# EAGLE design PGTNX01_teensy (EAGLE 8.5.2)
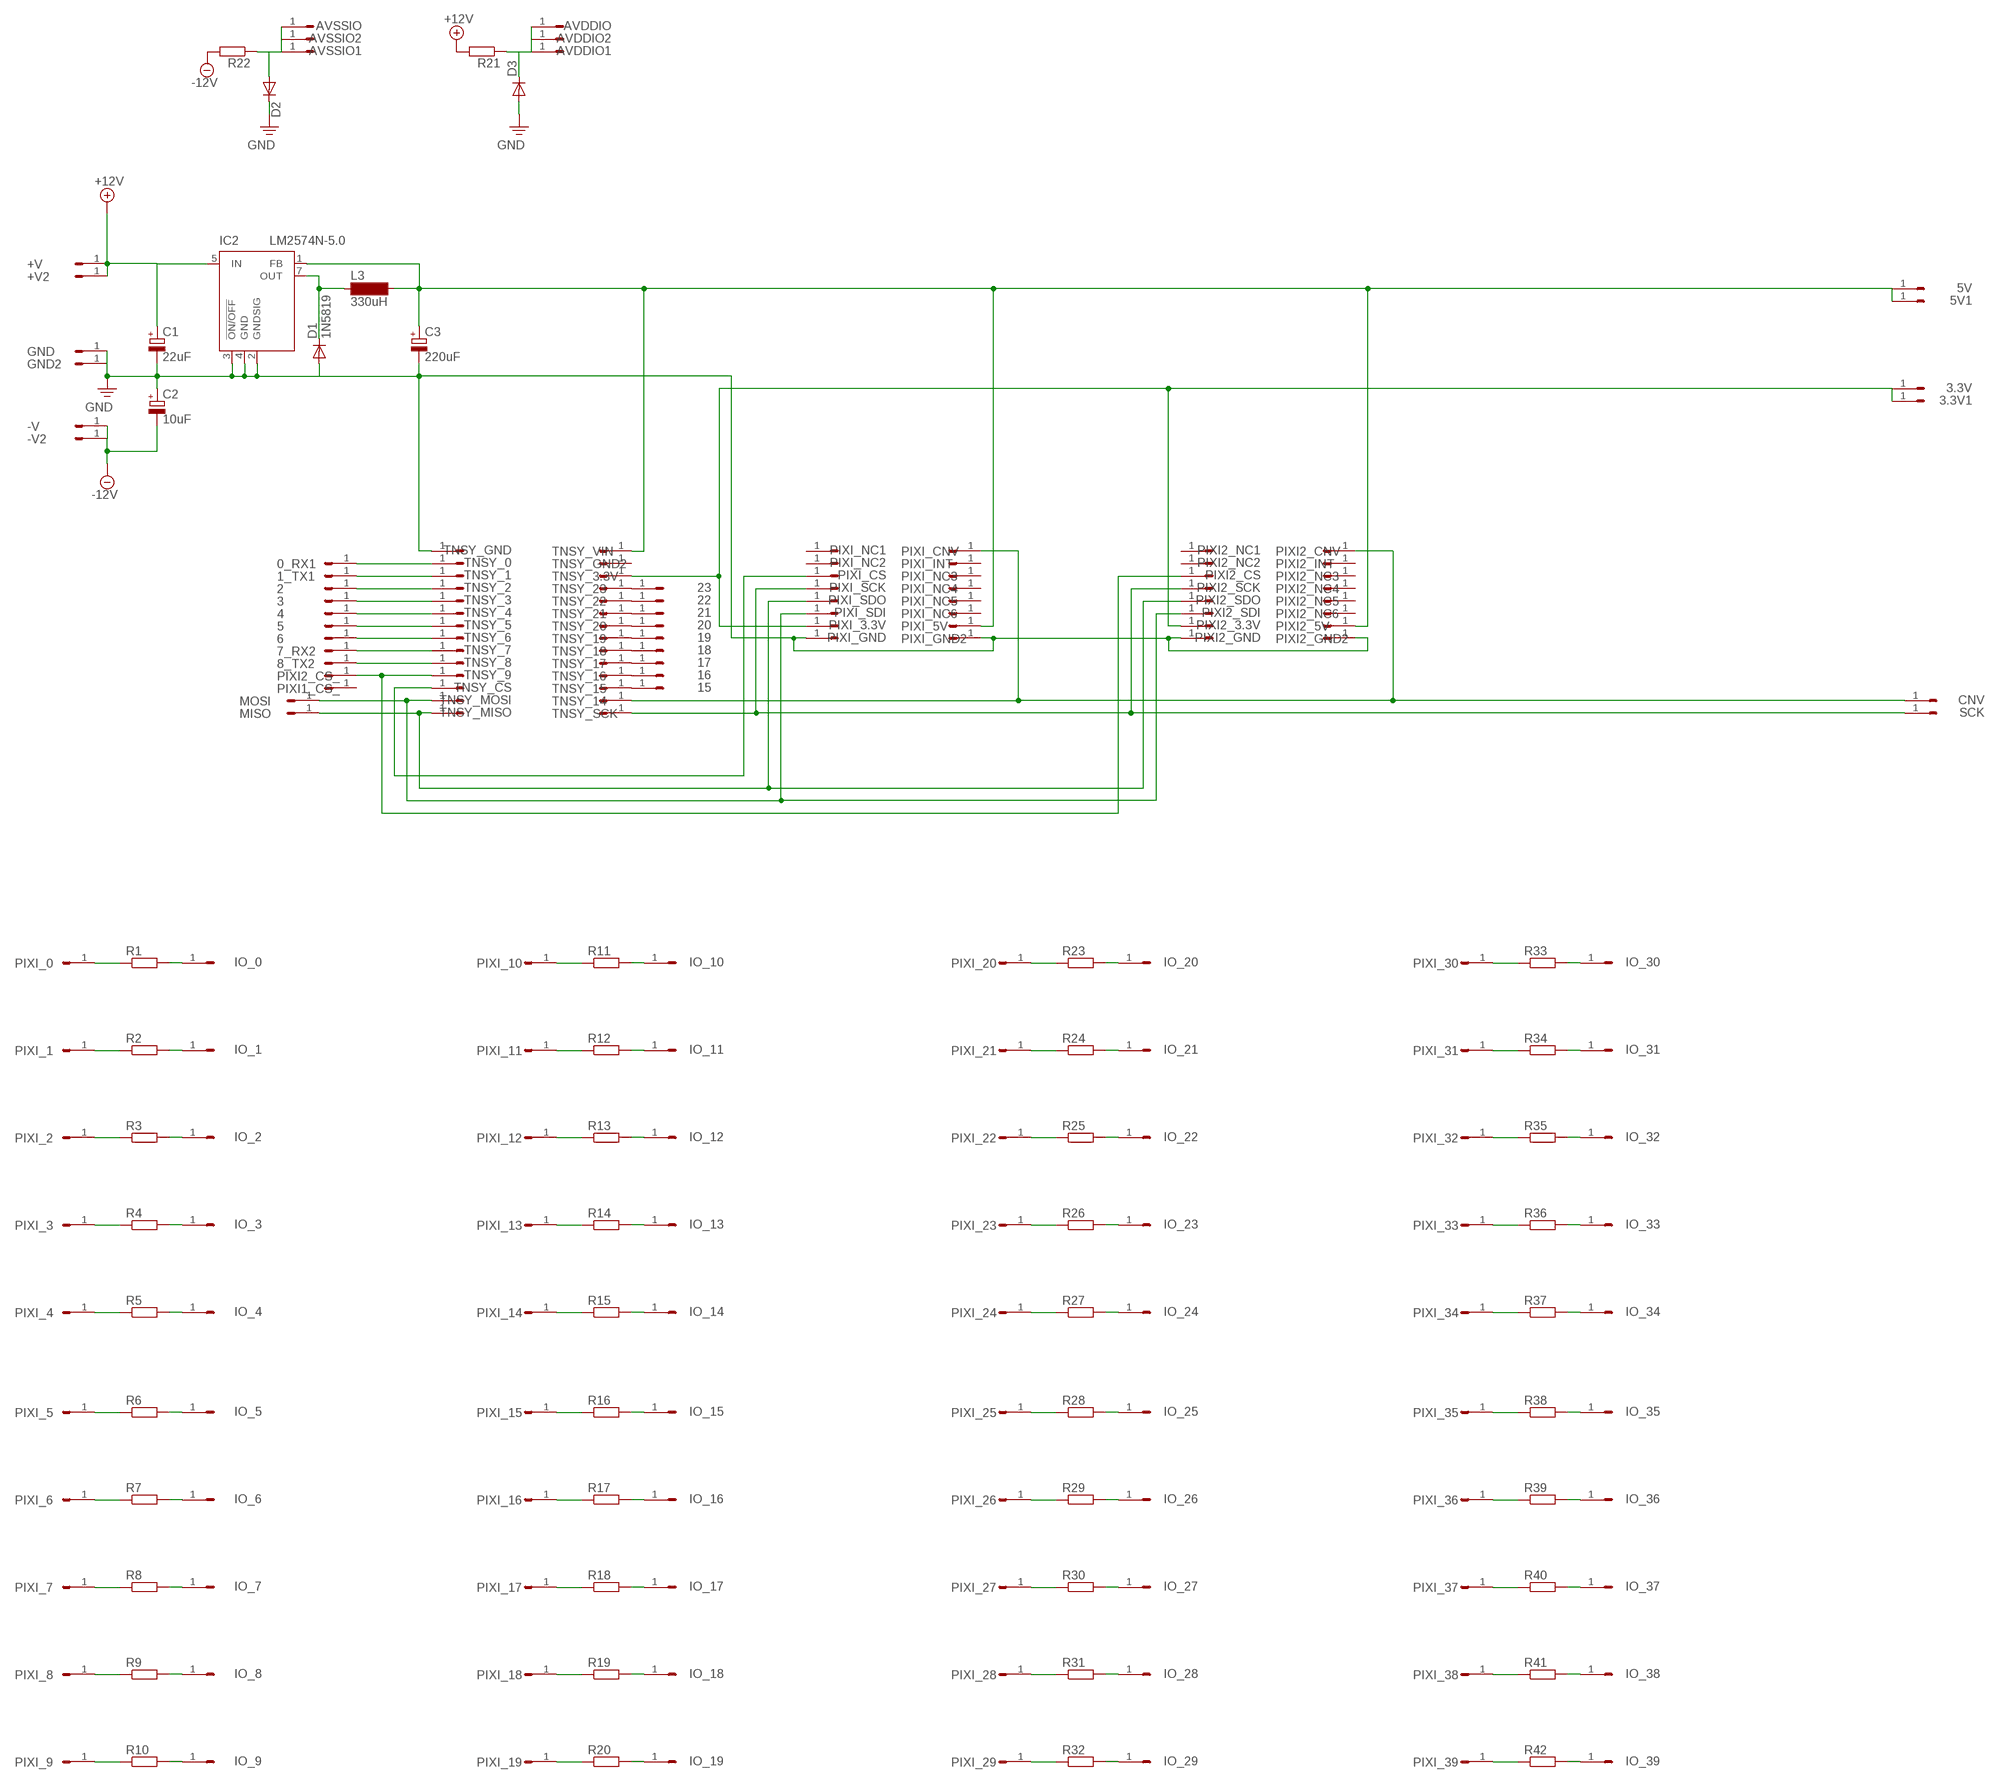
[diagram p0: schematic, sheet 1]

## Parts
0_RX1  HEADER/MALE/01  [HEADER/MALE/01]
1_TX1  HEADER/MALE/01  [HEADER/MALE/01]
2  HEADER/MALE/01  [HEADER/MALE/01]
3  HEADER/MALE/01  [HEADER/MALE/01]
3.3V  HEADER/MALE/01  [HEADER/MALE/01]
3.3V1  HEADER/MALE/01  [HEADER/MALE/01]
4  HEADER/MALE/01  [HEADER/MALE/01]
5  HEADER/MALE/01  [HEADER/MALE/01]
5V  HEADER/MALE/01  [HEADER/MALE/01]
5V1  HEADER/MALE/01  [HEADER/MALE/01]
6  HEADER/MALE/01  [HEADER/MALE/01]
7_RX2  HEADER/MALE/01  [HEADER/MALE/01]
8_TX2  HEADER/MALE/01  [HEADER/MALE/01]
15  HEADER/MALE/01  [HEADER/MALE/01]
16  HEADER/MALE/01  [HEADER/MALE/01]
17  HEADER/MALE/01  [HEADER/MALE/01]
18  HEADER/MALE/01  [HEADER/MALE/01]
19  HEADER/MALE/01  [HEADER/MALE/01]
20  HEADER/MALE/01  [HEADER/MALE/01]
21  HEADER/MALE/01  [HEADER/MALE/01]
22  HEADER/MALE/01  [HEADER/MALE/01]
23  HEADER/MALE/01  [HEADER/MALE/01]
+V  HEADER/MALE/01  [HEADER/MALE/01]
+V2  HEADER/MALE/01  [HEADER/MALE/01]
-V  HEADER/MALE/01  [HEADER/MALE/01]
-V2  HEADER/MALE/01  [HEADER/MALE/01]
AVDDIO  HEADER/MALE/01  [HEADER/MALE/01]
AVDDIO1  HEADER/MALE/01  [HEADER/MALE/01]
AVDDIO2  HEADER/MALE/01  [HEADER/MALE/01]
AVSSIO  HEADER/MALE/01  [HEADER/MALE/01]
AVSSIO1  HEADER/MALE/01  [HEADER/MALE/01]
AVSSIO2  HEADER/MALE/01  [HEADER/MALE/01]
C1  22uF  CAPACITOR/POLARIZEDE5-10.5  [E5-10,5]
C2  10uF  CAPACITOR/POLARIZEDE2.5-6  [E2,5-6]
C3  220uF  CAPACITOR/POLARIZEDE2.5-6  [E2,5-6]
CNV  HEADER/MALE/01  [HEADER/MALE/01]
D1  1N5819  1N4148DO35-7  [DO35-7]
D2  1N4148DO35-7  [DO35-7]
D3  1N4148DO35-7  [DO35-7]
GND  HEADER/MALE/01  [HEADER/MALE/01]
GND2  HEADER/MALE/01  [HEADER/MALE/01]
IC2  LM2574N-5.0  [DIL08]
IO_0  HEADER/MALE/01  [HEADER/MALE/01]
IO_1  HEADER/MALE/01  [HEADER/MALE/01]
IO_2  HEADER/MALE/01  [HEADER/MALE/01]
IO_3  HEADER/MALE/01  [HEADER/MALE/01]
IO_4  HEADER/MALE/01  [HEADER/MALE/01]
IO_5  HEADER/MALE/01  [HEADER/MALE/01]
IO_6  HEADER/MALE/01  [HEADER/MALE/01]
IO_7  HEADER/MALE/01  [HEADER/MALE/01]
IO_8  HEADER/MALE/01  [HEADER/MALE/01]
IO_9  HEADER/MALE/01  [HEADER/MALE/01]
IO_10  HEADER/MALE/01  [HEADER/MALE/01]
IO_11  HEADER/MALE/01  [HEADER/MALE/01]
IO_12  HEADER/MALE/01  [HEADER/MALE/01]
IO_13  HEADER/MALE/01  [HEADER/MALE/01]
IO_14  HEADER/MALE/01  [HEADER/MALE/01]
IO_15  HEADER/MALE/01  [HEADER/MALE/01]
IO_16  HEADER/MALE/01  [HEADER/MALE/01]
IO_17  HEADER/MALE/01  [HEADER/MALE/01]
IO_18  HEADER/MALE/01  [HEADER/MALE/01]
IO_19  HEADER/MALE/01  [HEADER/MALE/01]
IO_20  HEADER/MALE/01  [HEADER/MALE/01]
IO_21  HEADER/MALE/01  [HEADER/MALE/01]
IO_22  HEADER/MALE/01  [HEADER/MALE/01]
IO_23  HEADER/MALE/01  [HEADER/MALE/01]
IO_24  HEADER/MALE/01  [HEADER/MALE/01]
IO_25  HEADER/MALE/01  [HEADER/MALE/01]
IO_26  HEADER/MALE/01  [HEADER/MALE/01]
IO_27  HEADER/MALE/01  [HEADER/MALE/01]
IO_28  HEADER/MALE/01  [HEADER/MALE/01]
IO_29  HEADER/MALE/01  [HEADER/MALE/01]
IO_30  HEADER/MALE/01  [HEADER/MALE/01]
IO_31  HEADER/MALE/01  [HEADER/MALE/01]
IO_32  HEADER/MALE/01  [HEADER/MALE/01]
IO_33  HEADER/MALE/01  [HEADER/MALE/01]
IO_34  HEADER/MALE/01  [HEADER/MALE/01]
IO_35  HEADER/MALE/01  [HEADER/MALE/01]
IO_36  HEADER/MALE/01  [HEADER/MALE/01]
IO_37  HEADER/MALE/01  [HEADER/MALE/01]
IO_38  HEADER/MALE/01  [HEADER/MALE/01]
IO_39  HEADER/MALE/01  [HEADER/MALE/01]
L3  330uH  BS11  [BS11]
MISO  HEADER/MALE/01  [HEADER/MALE/01]
MOSI  HEADER/MALE/01  [HEADER/MALE/01]
PIXI1_CS_  HEADER/MALE/01  [HEADER/MALE/01]
PIXI2_3.3V  HEADER/MALE/01  [HEADER/MALE/01]
PIXI2_5V  HEADER/MALE/01  [HEADER/MALE/01]
PIXI2_CNV  HEADER/MALE/01  [HEADER/MALE/01]
PIXI2_CS  HEADER/MALE/01  [HEADER/MALE/01]
PIXI2_CS_  HEADER/MALE/01  [HEADER/MALE/01]
PIXI2_GND  HEADER/MALE/01  [HEADER/MALE/01]
PIXI2_GND2  HEADER/MALE/01  [HEADER/MALE/01]
PIXI2_INT  HEADER/MALE/01  [HEADER/MALE/01]
PIXI2_NC1  HEADER/MALE/01  [HEADER/MALE/01]
PIXI2_NC2  HEADER/MALE/01  [HEADER/MALE/01]
PIXI2_NC3  HEADER/MALE/01  [HEADER/MALE/01]
PIXI2_NC4  HEADER/MALE/01  [HEADER/MALE/01]
PIXI2_NC5  HEADER/MALE/01  [HEADER/MALE/01]
PIXI2_NC6  HEADER/MALE/01  [HEADER/MALE/01]
PIXI2_SCK  HEADER/MALE/01  [HEADER/MALE/01]
PIXI2_SDI  HEADER/MALE/01  [HEADER/MALE/01]
PIXI2_SDO  HEADER/MALE/01  [HEADER/MALE/01]
PIXI_0  HEADER/MALE/01  [HEADER/MALE/01]
PIXI_1  HEADER/MALE/01  [HEADER/MALE/01]
PIXI_2  HEADER/MALE/01  [HEADER/MALE/01]
PIXI_3  HEADER/MALE/01  [HEADER/MALE/01]
PIXI_3.3V  HEADER/MALE/01  [HEADER/MALE/01]
PIXI_4  HEADER/MALE/01  [HEADER/MALE/01]
PIXI_5  HEADER/MALE/01  [HEADER/MALE/01]
PIXI_5V  HEADER/MALE/01  [HEADER/MALE/01]
PIXI_6  HEADER/MALE/01  [HEADER/MALE/01]
PIXI_7  HEADER/MALE/01  [HEADER/MALE/01]
PIXI_8  HEADER/MALE/01  [HEADER/MALE/01]
PIXI_9  HEADER/MALE/01  [HEADER/MALE/01]
PIXI_10  HEADER/MALE/01  [HEADER/MALE/01]
PIXI_11  HEADER/MALE/01  [HEADER/MALE/01]
PIXI_12  HEADER/MALE/01  [HEADER/MALE/01]
PIXI_13  HEADER/MALE/01  [HEADER/MALE/01]
PIXI_14  HEADER/MALE/01  [HEADER/MALE/01]
PIXI_15  HEADER/MALE/01  [HEADER/MALE/01]
PIXI_16  HEADER/MALE/01  [HEADER/MALE/01]
PIXI_17  HEADER/MALE/01  [HEADER/MALE/01]
PIXI_18  HEADER/MALE/01  [HEADER/MALE/01]
PIXI_19  HEADER/MALE/01  [HEADER/MALE/01]
PIXI_20  HEADER/MALE/01  [HEADER/MALE/01]
PIXI_21  HEADER/MALE/01  [HEADER/MALE/01]
PIXI_22  HEADER/MALE/01  [HEADER/MALE/01]
PIXI_23  HEADER/MALE/01  [HEADER/MALE/01]
PIXI_24  HEADER/MALE/01  [HEADER/MALE/01]
PIXI_25  HEADER/MALE/01  [HEADER/MALE/01]
PIXI_26  HEADER/MALE/01  [HEADER/MALE/01]
PIXI_27  HEADER/MALE/01  [HEADER/MALE/01]
PIXI_28  HEADER/MALE/01  [HEADER/MALE/01]
PIXI_29  HEADER/MALE/01  [HEADER/MALE/01]
PIXI_30  HEADER/MALE/01  [HEADER/MALE/01]
PIXI_31  HEADER/MALE/01  [HEADER/MALE/01]
PIXI_32  HEADER/MALE/01  [HEADER/MALE/01]
PIXI_33  HEADER/MALE/01  [HEADER/MALE/01]
PIXI_34  HEADER/MALE/01  [HEADER/MALE/01]
PIXI_35  HEADER/MALE/01  [HEADER/MALE/01]
PIXI_36  HEADER/MALE/01  [HEADER/MALE/01]
PIXI_37  HEADER/MALE/01  [HEADER/MALE/01]
PIXI_38  HEADER/MALE/01  [HEADER/MALE/01]
PIXI_39  HEADER/MALE/01  [HEADER/MALE/01]
PIXI_CNV  HEADER/MALE/01  [HEADER/MALE/01]
PIXI_CS  HEADER/MALE/01  [HEADER/MALE/01]
PIXI_GND  HEADER/MALE/01  [HEADER/MALE/01]
PIXI_GND2  HEADER/MALE/01  [HEADER/MALE/01]
PIXI_INT  HEADER/MALE/01  [HEADER/MALE/01]
PIXI_NC1  HEADER/MALE/01  [HEADER/MALE/01]
PIXI_NC2  HEADER/MALE/01  [HEADER/MALE/01]
PIXI_NC3  HEADER/MALE/01  [HEADER/MALE/01]
PIXI_NC4  HEADER/MALE/01  [HEADER/MALE/01]
PIXI_NC5  HEADER/MALE/01  [HEADER/MALE/01]
PIXI_NC6  HEADER/MALE/01  [HEADER/MALE/01]
PIXI_SCK  HEADER/MALE/01  [HEADER/MALE/01]
PIXI_SDI  HEADER/MALE/01  [HEADER/MALE/01]
PIXI_SDO  HEADER/MALE/01  [HEADER/MALE/01]
R1  RESISTORRESISTOR/UPRIGHT/7.5  [RESISTOR/7.5]
R2  RESISTORRESISTOR/UPRIGHT/7.5  [RESISTOR/7.5]
R3  RESISTORRESISTOR/UPRIGHT/7.5  [RESISTOR/7.5]
R4  RESISTORRESISTOR/UPRIGHT/7.5  [RESISTOR/7.5]
R5  RESISTORRESISTOR/UPRIGHT/7.5  [RESISTOR/7.5]
R6  RESISTORRESISTOR/UPRIGHT/7.5  [RESISTOR/7.5]
R7  RESISTORRESISTOR/UPRIGHT/7.5  [RESISTOR/7.5]
R8  RESISTORRESISTOR/UPRIGHT/7.5  [RESISTOR/7.5]
R9  RESISTORRESISTOR/UPRIGHT/7.5  [RESISTOR/7.5]
R10  RESISTORRESISTOR/UPRIGHT/7.5  [RESISTOR/7.5]
R11  RESISTORRESISTOR/UPRIGHT/7.5  [RESISTOR/7.5]
R12  RESISTORRESISTOR/UPRIGHT/7.5  [RESISTOR/7.5]
R13  RESISTORRESISTOR/UPRIGHT/7.5  [RESISTOR/7.5]
R14  RESISTORRESISTOR/UPRIGHT/7.5  [RESISTOR/7.5]
R15  RESISTORRESISTOR/UPRIGHT/7.5  [RESISTOR/7.5]
R16  RESISTORRESISTOR/UPRIGHT/7.5  [RESISTOR/7.5]
R17  RESISTORRESISTOR/UPRIGHT/7.5  [RESISTOR/7.5]
R18  RESISTORRESISTOR/UPRIGHT/7.5  [RESISTOR/7.5]
R19  RESISTORRESISTOR/UPRIGHT/7.5  [RESISTOR/7.5]
R20  RESISTORRESISTOR/UPRIGHT/7.5  [RESISTOR/7.5]
R21  RESISTORRESISTOR/UPRIGHT/7.5  [RESISTOR/7.5]
R22  RESISTORRESISTOR/UPRIGHT/7.5  [RESISTOR/7.5]
R23  RESISTORRESISTOR/UPRIGHT/7.5  [RESISTOR/7.5]
R24  RESISTORRESISTOR/UPRIGHT/7.5  [RESISTOR/7.5]
R25  RESISTORRESISTOR/UPRIGHT/7.5  [RESISTOR/7.5]
R26  RESISTORRESISTOR/UPRIGHT/7.5  [RESISTOR/7.5]
R27  RESISTORRESISTOR/UPRIGHT/7.5  [RESISTOR/7.5]
R28  RESISTORRESISTOR/UPRIGHT/7.5  [RESISTOR/7.5]
R29  RESISTORRESISTOR/UPRIGHT/7.5  [RESISTOR/7.5]
R30  RESISTORRESISTOR/UPRIGHT/7.5  [RESISTOR/7.5]
R31  RESISTORRESISTOR/UPRIGHT/7.5  [RESISTOR/7.5]
R32  RESISTORRESISTOR/UPRIGHT/7.5  [RESISTOR/7.5]
R33  RESISTORRESISTOR/UPRIGHT/7.5  [RESISTOR/7.5]
R34  RESISTORRESISTOR/UPRIGHT/7.5  [RESISTOR/7.5]
R35  RESISTORRESISTOR/UPRIGHT/7.5  [RESISTOR/7.5]
R36  RESISTORRESISTOR/UPRIGHT/7.5  [RESISTOR/7.5]
R37  RESISTORRESISTOR/UPRIGHT/7.5  [RESISTOR/7.5]
R38  RESISTORRESISTOR/UPRIGHT/7.5  [RESISTOR/7.5]
R39  RESISTORRESISTOR/UPRIGHT/7.5  [RESISTOR/7.5]
R40  RESISTORRESISTOR/UPRIGHT/7.5  [RESISTOR/7.5]
R41  RESISTORRESISTOR/UPRIGHT/7.5  [RESISTOR/7.5]
R42  RESISTORRESISTOR/UPRIGHT/7.5  [RESISTOR/7.5]
SCK  HEADER/MALE/01  [HEADER/MALE/01]
TNSY_0  HEADER/MALE/01  [HEADER/MALE/01]
TNSY_1  HEADER/MALE/01  [HEADER/MALE/01]
TNSY_2  HEADER/MALE/01  [HEADER/MALE/01]
TNSY_3  HEADER/MALE/01  [HEADER/MALE/01]
TNSY_3.3V  HEADER/MALE/01  [HEADER/MALE/01]
TNSY_4  HEADER/MALE/01  [HEADER/MALE/01]
TNSY_5  HEADER/MALE/01  [HEADER/MALE/01]
TNSY_6  HEADER/MALE/01  [HEADER/MALE/01]
TNSY_7  HEADER/MALE/01  [HEADER/MALE/01]
TNSY_8  HEADER/MALE/01  [HEADER/MALE/01]
TNSY_9  HEADER/MALE/01  [HEADER/MALE/01]
TNSY_14  HEADER/MALE/01  [HEADER/MALE/01]
TNSY_15  HEADER/MALE/01  [HEADER/MALE/01]
TNSY_16  HEADER/MALE/01  [HEADER/MALE/01]
TNSY_17  HEADER/MALE/01  [HEADER/MALE/01]
TNSY_18  HEADER/MALE/01  [HEADER/MALE/01]
TNSY_19  HEADER/MALE/01  [HEADER/MALE/01]
TNSY_20  HEADER/MALE/01  [HEADER/MALE/01]
TNSY_21  HEADER/MALE/01  [HEADER/MALE/01]
TNSY_22  HEADER/MALE/01  [HEADER/MALE/01]
TNSY_23  HEADER/MALE/01  [HEADER/MALE/01]
TNSY_CS  HEADER/MALE/01  [HEADER/MALE/01]
TNSY_GND  HEADER/MALE/01  [HEADER/MALE/01]
TNSY_GND2  HEADER/MALE/01  [HEADER/MALE/01]
TNSY_MISO  HEADER/MALE/01  [HEADER/MALE/01]
TNSY_MOSI  HEADER/MALE/01  [HEADER/MALE/01]
TNSY_SCK  HEADER/MALE/01  [HEADER/MALE/01]
TNSY_VIN  HEADER/MALE/01  [HEADER/MALE/01]

## Nets
+12V: +V2.1 +V.1 C1.+ IC2.5(IN) R21.2
-12V: -V2.1 -V.1 C2.- R22.2
GND: C1.- C2.+ C3.- D1.A D2.C D3.A GND2.1 GND.1 IC2.2(GNDSIG) IC2.3(!ON/OFF) IC2.4(GND) PIXI2_GND2.1 PIXI2_GND.1 PIXI_GND2.1 PIXI_GND.1 TNSY_GND.1
N$1: 3.3V1.1 3.3V.1 PIXI2_3.3V.1 PIXI_3.3V.1 TNSY_3.3V.1
N$2: 17.1 TNSY_17.1
N$3: 1_TX1.1 TNSY_1.1
N$4: 16.1 TNSY_16.1
N$5: D1.C IC2.7(OUT) L3.1
N$6: MISO.1 PIXI2_SDO.1 PIXI_SDO.1 TNSY_MISO.1
N$7: 5V1.1 5V.1 C3.+ IC2.1(FB) L3.2 PIXI2_5V.1 PIXI_5V.1 TNSY_VIN.1
N$8: PIXI_CS.1 TNSY_CS.1
N$9: 0_RX1.1 TNSY_0.1
N$10: 7_RX2.1 TNSY_7.1
N$11: 18.1 TNSY_18.1
N$12: 19.1 TNSY_19.1
N$13: 20.1 TNSY_20.1
N$14: 21.1 TNSY_21.1
N$15: 22.1 TNSY_22.1
N$16: 23.1 TNSY_23.1
N$17: 8_TX2.1 TNSY_8.1
N$18: 15.1 TNSY_15.1
N$19: 2.1 TNSY_2.1
N$20: 3.1 TNSY_3.1
N$21: 4.1 TNSY_4.1
N$22: 5.1 TNSY_5.1
N$23: PIXI_0.1 R1.1
N$24: IO_0.1 R1.2
N$25: PIXI_1.1 R2.1
N$26: 6.1 TNSY_6.1
N$27: IO_1.1 R2.2
N$28: CNV.1 PIXI2_CNV.1 PIXI_CNV.1 TNSY_14.1
N$29: MOSI.1 PIXI2_SDI.1 PIXI_SDI.1 TNSY_MOSI.1
N$30: PIXI_2.1 R3.1
N$31: PIXI2_SCK.1 PIXI_SCK.1 SCK.1 TNSY_SCK.1
N$32: PIXI2_CS.1 PIXI2_CS_.1 TNSY_9.1
N$33: IO_2.1 R3.2
N$34: PIXI_3.1 R4.1
N$35: IO_3.1 R4.2
N$36: PIXI_4.1 R5.1
N$37: IO_4.1 R5.2
N$38: PIXI_5.1 R6.1
N$39: IO_5.1 R6.2
N$40: PIXI_6.1 R7.1
N$41: IO_6.1 R7.2
N$42: PIXI_7.1 R8.1
N$43: IO_7.1 R8.2
N$44: PIXI_8.1 R9.1
N$45: IO_8.1 R9.2
N$46: PIXI_9.1 R10.1
N$47: IO_9.1 R10.2
N$48: PIXI_10.1 R11.1
N$49: IO_10.1 R11.2
N$50: PIXI_11.1 R12.1
N$51: IO_11.1 R12.2
N$52: PIXI_12.1 R13.1
N$53: IO_12.1 R13.2
N$54: PIXI_13.1 R14.1
N$55: IO_13.1 R14.2
N$56: PIXI_14.1 R15.1
N$57: IO_14.1 R15.2
N$58: PIXI_15.1 R16.1
N$59: IO_15.1 R16.2
N$60: PIXI_16.1 R17.1
N$61: IO_16.1 R17.2
N$62: PIXI_17.1 R18.1
N$63: IO_17.1 R18.2
N$64: PIXI_18.1 R19.1
N$65: IO_18.1 R19.2
N$66: AVDDIO1.1 AVDDIO2.1 AVDDIO.1 D3.C R21.1
N$67: AVSSIO1.1 AVSSIO2.1 AVSSIO.1 D2.A R22.1
N$68: PIXI_19.1 R20.1
N$69: IO_19.1 R20.2
N$70: PIXI_20.1 R23.1
N$71: IO_20.1 R23.2
N$72: PIXI_21.1 R24.1
N$73: IO_21.1 R24.2
N$74: PIXI_22.1 R25.1
N$75: IO_22.1 R25.2
N$76: PIXI_23.1 R26.1
N$77: IO_23.1 R26.2
N$78: PIXI_24.1 R27.1
N$79: IO_24.1 R27.2
N$80: PIXI_25.1 R28.1
N$81: IO_25.1 R28.2
N$82: PIXI_26.1 R29.1
N$83: IO_26.1 R29.2
N$84: PIXI_27.1 R30.1
N$85: IO_27.1 R30.2
N$86: PIXI_28.1 R31.1
N$87: IO_28.1 R31.2
N$88: PIXI_29.1 R32.1
N$89: IO_29.1 R32.2
N$90: PIXI_30.1 R33.1
N$91: IO_30.1 R33.2
N$92: PIXI_31.1 R34.1
N$93: IO_31.1 R34.2
N$94: PIXI_32.1 R35.1
N$95: IO_32.1 R35.2
N$96: PIXI_33.1 R36.1
N$97: IO_33.1 R36.2
N$98: PIXI_34.1 R37.1
N$99: IO_34.1 R37.2
N$100: PIXI_35.1 R38.1
N$101: IO_35.1 R38.2
N$102: PIXI_36.1 R39.1
N$103: IO_36.1 R39.2
N$104: PIXI_37.1 R40.1
N$105: IO_37.1 R40.2
N$106: PIXI_38.1 R41.1
N$107: IO_38.1 R41.2
N$108: PIXI_39.1 R42.1
N$109: IO_39.1 R42.2
Unconnected: PIXI1_CS_.1 PIXI2_INT.1 PIXI2_NC1.1 PIXI2_NC2.1 PIXI2_NC3.1 PIXI2_NC4.1 PIXI2_NC5.1 PIXI2_NC6.1 PIXI_INT.1 PIXI_NC1.1 PIXI_NC2.1 PIXI_NC3.1 PIXI_NC4.1 PIXI_NC5.1 PIXI_NC6.1 TNSY_GND2.1

## Library data of the parts
0_RX1 1_TX1 2 3 3.3V 3.3V1 4 5 5V 5V1 6 7_RX2 8_TX2 15-23 +V +V2 -V -V2 AVDDIO AVDDIO1 AVDDIO2 AVSSIO AVSSIO1 AVSSIO2 CNV GND GND2 IO_0 IO_1-IO_39 MISO MOSI PIXI1_CS_ PIXI2_3.3V PIXI2_5V PIXI2_CNV PIXI2_CS PIXI2_CS_ PIXI2_GND PIXI2_GND2 PIXI2_INT PIXI2_NC1-PIXI2_NC6 PIXI2_SCK PIXI2_SDI PIXI2_SDO PIXI_0 PIXI_1-PIXI_3 PIXI_3.3V PIXI_4 PIXI_5 PIXI_5V PIXI_6-PIXI_39 PIXI_CNV PIXI_CS PIXI_GND PIXI_GND2 PIXI_INT PIXI_NC1-PIXI_NC6 PIXI_SCK PIXI_SDI PIXI_SDO SCK TNSY_0 TNSY_1-TNSY_3 TNSY_3.3V TNSY_4-TNSY_9 TNSY_14-TNSY_23 TNSY_CS TNSY_GND TNSY_GND2 TNSY_MISO TNSY_MOSI TNSY_SCK TNSY_VIN = connectors:HEADER/MALE/01; SPICEPREFIX: X
C1-C3 = capacitors:CAPACITOR/POLARIZED: POLARIZED CAPACITOR, European symbol; SPICEPREFIX: C
D1-D3 = transistors:1N4148: DIODE high speed (Philips)
IC2 = linear:LM2574?-*: SIMPLE SWITCHER 0.5A Step-Down Voltage Regulator Source: http://cache.national.com/ds/LM/LM2574.pdf
L3 = inductor-neosid:BS: INDUCTOR nominal inductance, magnetically screened; OC_FARNELL: unknown; OC_NEWARK: unknown
R1-R42 = resistors:RESISTOR: RESISTOR, European symbol

## Board
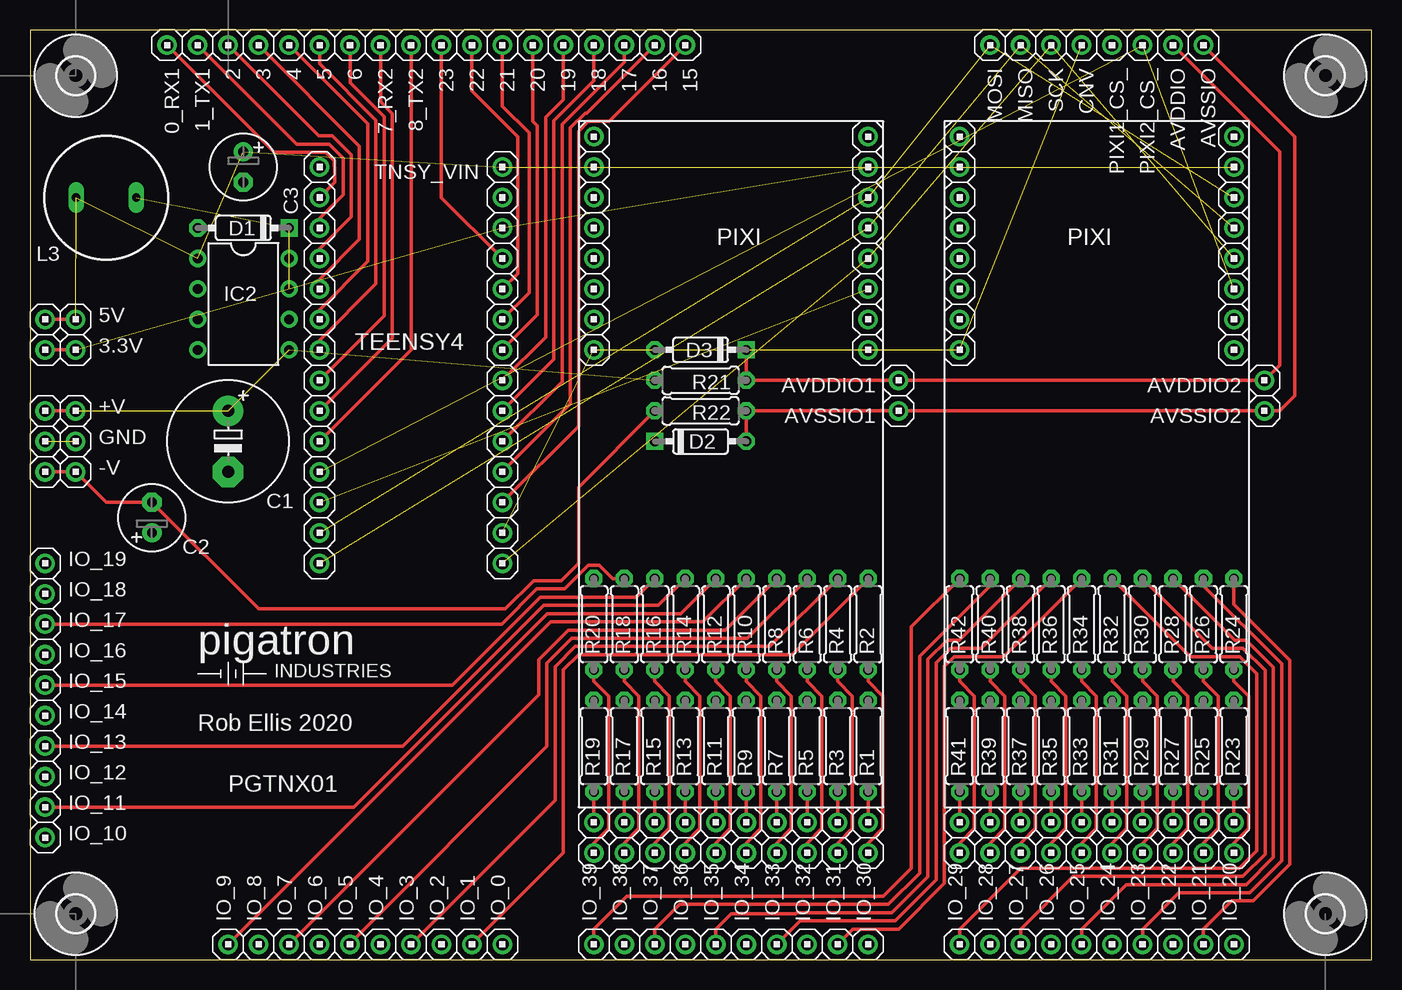
[diagram p1: board, top side]
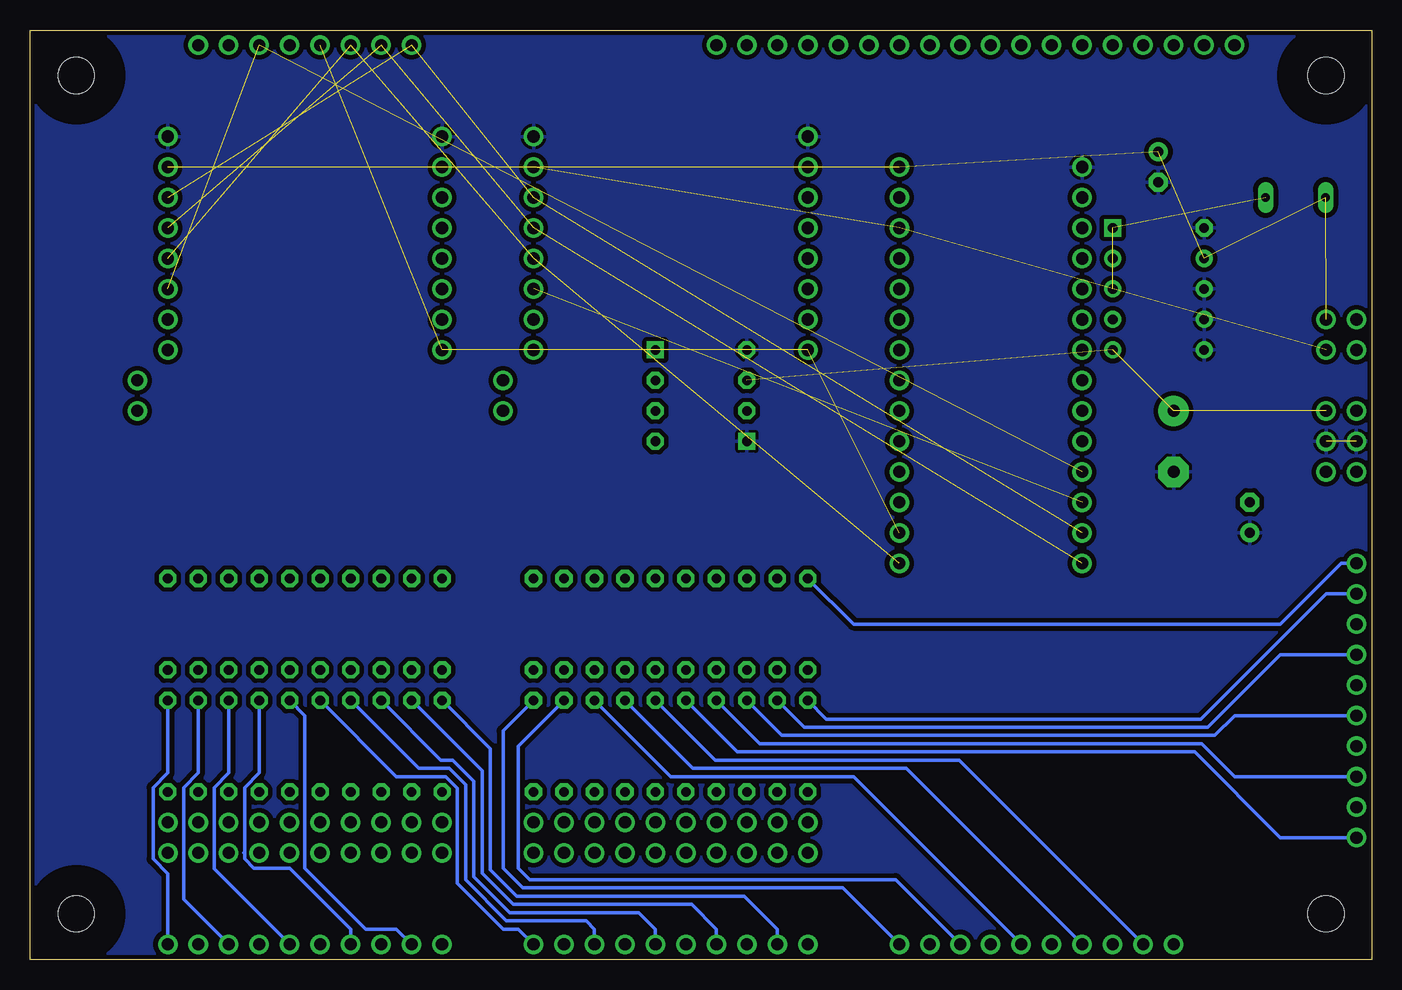
[diagram p2: board, bottom side, seen from below]

Size 111.81 x 77.46 mm. Coordinates in mm from the lower left corner, seen from the top.
Outline: 0,0 111.81,0 111.81,77.46 0,77.46 0,0
Copper layers (1*16): Top 0.0356mm / dielectric 1.5011mm / Bottom 0.0356mm
Design rules "pigatron": minimum track width 12mil, minimum drill 13mil, track to track 15mil, track to pad 10mil, pad to pad 10mil, via to via 10mil, smd to smd 6mil, copper to edge 15mil, drill to drill 10mil, minimum pad ring 12mil, minimum via ring 10mil, stop-mask expansion 4mil, vias tented up to drill 0mil, thermal gap 10mil

### Footprints (pad centres in the part's own frame; a part is rotated, then mirrored left to right if it is on the bottom)
HEADER/MALE/01 = drill 1.016: 1 0,0
E5-10,5 = drill 1.016 pad 2.54: + -2.54,0 | drill 1.016 pad 2.54 octagon: - 2.54,0
E2,5-6 = drill 0.813 pad 1.6: + -1.27,0 | drill 0.813 pad 1.6 octagon: - 1.27,0
DO35-7 = drill 0.813 octagon: A 3.81,0 | drill 0.813 square: C -3.81,0
DIL08 = drill 0.813 pad 1.27: 1 -3.81,-3.81; 2 -1.27,-3.81; 3 1.27,-3.81; 4 3.81,-3.81; 5 3.81,3.81; 6 1.27,3.81; 7 -1.27,3.81; 8 -3.81,3.81
BS11 = drill 0.7 long: 1 -2.5,0; 2 2.5,0
RESISTOR/7.5 = drill 0.813 octagon: 1 -3.81,0; 2 3.81,0
STANDOFF/3.0 = hole 3: 0,0

### Placement (x,y rotation side)
0_RX1  11.43,76.2 270 top
1_TX1  13.97,76.2 270 top
2  16.51,76.2 270 top
3  19.05,76.2 270 top
3.3V  3.81,50.8 0 top
3.3V1  1.27,50.8 0 top
4  21.59,76.2 270 top
5  24.13,76.2 270 top
5V  3.81,53.34 0 top
5V1  1.27,53.34 0 top
6  26.67,76.2 270 top
7_RX2  29.21,76.2 270 top
8_TX2  31.75,76.2 270 top
15  54.61,76.2 270 top
16  52.07,76.2 270 top
17  49.53,76.2 270 top
18  46.99,76.2 270 top
19  44.45,76.2 270 top
20  41.91,76.2 270 top
21  39.37,76.2 270 top
22  36.83,76.2 270 top
23  34.29,76.2 270 top
+V  3.81,45.72 0 top
+V2  1.27,45.72 0 top
-V  3.81,40.64 0 top
-V2  1.27,40.64 0 top
AVDDIO  95.25,76.2 270 top
AVDDIO1  72.39,48.26 180 top
AVDDIO2  102.87,48.26 180 top
AVSSIO  97.79,76.2 270 top
AVSSIO1  72.39,45.72 180 top
AVSSIO2  102.87,45.72 180 top
C1  16.51,43.18 270 top
C2  10.16,36.83 90 top
C3  17.78,66.04 270 top
CNV  87.63,76.2 270 top
D1  17.78,60.96 180 top
D2  55.88,43.18 0 top
D3  55.88,50.8 180 top
GND  3.81,43.18 0 top
GND2  1.27,43.18 0 top
IC2  17.78,54.61 270 top
IO_0  39.37,1.27 90 top
IO_1  36.83,1.27 90 top
IO_2  34.29,1.27 90 top
IO_3  31.75,1.27 90 top
IO_4  29.21,1.27 90 top
IO_5  26.67,1.27 90 top
IO_6  24.13,1.27 90 top
IO_7  21.59,1.27 90 top
IO_8  19.05,1.27 90 top
IO_9  16.51,1.27 90 top
IO_10  1.27,10.16 0 top
IO_11  1.27,12.7 0 top
IO_12  1.27,15.24 0 top
IO_13  1.27,17.78 0 top
IO_14  1.27,20.32 0 top
IO_15  1.27,22.86 0 top
IO_16  1.27,25.4 0 top
IO_17  1.27,27.94 0 top
IO_18  1.27,30.48 0 top
IO_19  1.27,33.02 0 top
IO_20  100.33,1.27 90 top
IO_21  97.79,1.27 90 top
IO_22  95.25,1.27 90 top
IO_23  92.71,1.27 90 top
IO_24  90.17,1.27 90 top
IO_25  87.63,1.27 90 top
IO_26  85.09,1.27 90 top
IO_27  82.55,1.27 90 top
IO_28  80.01,1.27 90 top
IO_29  77.47,1.27 90 top
IO_30  69.85,1.27 90 top
IO_31  67.31,1.27 90 top
IO_32  64.77,1.27 90 top
IO_33  62.23,1.27 90 top
IO_34  59.69,1.27 90 top
IO_35  57.15,1.27 90 top
IO_36  54.61,1.27 90 top
IO_37  52.07,1.27 90 top
IO_38  49.53,1.27 90 top
IO_39  46.99,1.27 90 top
L3  6.35,63.5 180 top
MISO  82.55,76.2 270 top
MOSI  80.01,76.2 270 top
PIXI1_CS_  90.17,76.2 270 top
PIXI2_3.3V  100.33,66.04 0 top
PIXI2_5V  77.47,66.04 0 top
PIXI2_CNV  77.47,50.8 0 top
PIXI2_CS  100.33,55.88 0 top
PIXI2_CS_  92.71,76.2 270 top
PIXI2_GND  100.33,68.58 0 top
PIXI2_GND2  77.47,68.58 0 top
PIXI2_INT  77.47,53.34 0 top
PIXI2_NC1  100.33,50.8 0 top
PIXI2_NC2  100.33,53.34 0 top
PIXI2_NC3  77.47,63.5 0 top
PIXI2_NC4  77.47,60.96 0 top
PIXI2_NC5  77.47,58.42 0 top
PIXI2_NC6  77.47,55.88 0 top
PIXI2_SCK  100.33,58.42 0 top
PIXI2_SDI  100.33,63.5 0 top
PIXI2_SDO  100.33,60.96 0 top
PIXI_0  69.85,11.43 90 top
PIXI_1  69.85,8.89 270 top
PIXI_2  67.31,11.43 90 top
PIXI_3  67.31,8.89 270 top
PIXI_3.3V  69.85,66.04 180 top
PIXI_4  64.77,11.43 90 top
PIXI_5  64.77,8.89 270 top
PIXI_5V  46.99,66.04 0 top
PIXI_6  62.23,11.43 90 top
PIXI_7  62.23,8.89 270 top
PIXI_8  59.69,11.43 90 top
PIXI_9  59.69,8.89 270 top
PIXI_10  57.15,11.43 90 top
PIXI_11  57.15,8.89 270 top
PIXI_12  54.61,11.43 90 top
PIXI_13  54.61,8.89 270 top
PIXI_14  52.07,11.43 90 top
PIXI_15  52.07,8.89 270 top
PIXI_16  49.53,11.43 90 top
PIXI_17  49.53,8.89 270 top
PIXI_18  46.99,11.43 90 top
PIXI_19  46.99,8.89 270 top
PIXI_20  100.33,11.43 90 top
PIXI_21  100.33,8.89 270 top
PIXI_22  97.79,11.43 90 top
PIXI_23  97.79,8.89 270 top
PIXI_24  95.25,11.43 90 top
PIXI_25  95.25,8.89 270 top
PIXI_26  92.71,11.43 90 top
PIXI_27  92.71,8.89 270 top
PIXI_28  90.17,11.43 90 top
PIXI_29  90.17,8.89 270 top
PIXI_30  87.63,11.43 90 top
PIXI_31  87.63,8.89 270 top
PIXI_32  85.09,11.43 90 top
PIXI_33  85.09,8.89 270 top
PIXI_34  82.55,11.43 90 top
PIXI_35  82.55,8.89 270 top
PIXI_36  80.01,11.43 90 top
PIXI_37  80.01,8.89 270 top
PIXI_38  77.47,11.43 90 top
PIXI_39  77.47,8.89 270 top
PIXI_CNV  46.99,50.8 0 top
PIXI_CS  69.85,55.88 180 top
PIXI_GND  69.85,68.58 180 top
PIXI_GND2  46.99,68.58 0 top
PIXI_INT  46.99,53.34 0 top
PIXI_NC1  69.85,50.8 180 top
PIXI_NC2  69.85,53.34 180 top
PIXI_NC3  46.99,55.88 0 top
PIXI_NC4  46.99,58.42 0 top
PIXI_NC5  46.99,60.96 0 top
PIXI_NC6  46.99,63.5 0 top
PIXI_SCK  69.85,58.42 180 top
PIXI_SDI  69.85,63.5 180 top
PIXI_SDO  69.85,60.96 180 top
R1  69.85,17.78 90 top
R2  69.85,27.94 90 top
R3  67.31,17.78 90 top
R4  67.31,27.94 90 top
R5  64.77,17.78 90 top
R6  64.77,27.94 90 top
R7  62.23,17.78 90 top
R8  62.23,27.94 90 top
R9  59.69,17.78 90 top
R10  59.69,27.94 90 top
R11  57.15,17.78 90 top
R12  57.15,27.94 90 top
R13  54.61,17.78 90 top
R14  54.61,27.94 90 top
R15  52.07,17.78 90 top
R16  52.07,27.94 90 top
R17  49.53,17.78 90 top
R18  49.53,27.94 90 top
R19  46.99,17.78 90 top
R20  46.99,27.94 90 top
R21  55.88,48.26 180 top
R22  55.88,45.72 180 top
R23  100.33,17.78 90 top
R24  100.33,27.94 90 top
R25  97.79,17.78 90 top
R26  97.79,27.94 90 top
R27  95.25,17.78 90 top
R28  95.25,27.94 90 top
R29  92.71,17.78 90 top
R30  92.71,27.94 90 top
R31  90.17,17.78 90 top
R32  90.17,27.94 90 top
R33  87.63,17.78 90 top
R34  87.63,27.94 90 top
R35  85.09,17.78 90 top
R36  85.09,27.94 90 top
R37  82.55,17.78 90 top
R38  82.55,27.94 90 top
R39  80.01,17.78 90 top
R40  80.01,27.94 90 top
R41  77.47,17.78 90 top
R42  77.47,27.94 90 top
SCK  85.09,76.2 270 top
TNSY_0  24.13,63.5 0 top
TNSY_1  24.13,60.96 0 top
TNSY_2  24.13,58.42 0 top
TNSY_3  24.13,55.88 0 top
TNSY_3.3V  39.37,60.96 0 top
TNSY_4  24.13,53.34 0 top
TNSY_5  24.13,50.8 0 top
TNSY_6  24.13,48.26 0 top
TNSY_7  24.13,45.72 0 top
TNSY_8  24.13,43.18 0 top
TNSY_9  24.13,40.64 0 top
TNSY_14  39.37,35.56 0 top
TNSY_15  39.37,38.1 0 top
TNSY_16  39.37,40.64 0 top
TNSY_17  39.37,43.18 0 top
TNSY_18  39.37,45.72 0 top
TNSY_19  39.37,48.26 0 top
TNSY_20  39.37,50.8 0 top
TNSY_21  39.37,53.34 0 top
TNSY_22  39.37,55.88 0 top
TNSY_23  39.37,58.42 0 top
TNSY_CS  24.13,38.1 0 top
TNSY_GND  24.13,66.04 0 top
TNSY_GND2  39.37,63.5 0 top
TNSY_MISO  24.13,33.02 0 top
TNSY_MOSI  24.13,35.56 0 top
TNSY_SCK  39.37,33.02 0 top
TNSY_VIN  39.37,66.04 180 top
U$2  [STANDOFF/3.0]  3.81,73.66 0 top
U$3  [STANDOFF/3.0]  107.95,73.66 0 top
U$4  [STANDOFF/3.0]  107.95,3.81 0 top
U$5  [PIGATRON-LOGO]  22.86,25.4 0 top
U$7  [STANDOFF/3.0]  3.81,3.81 0 top

### Tracks (layer width: path | path; a pad name or v marks a point on that pad's centre or on a via)
+12V  (3 unrouted)
  Top 0.305: +V2.1 +V.1
-12V
  Top 0.305: R22.2 45.72,39.37 45.72,33.03 44.26,31.57 41.96,31.57 39.6,29.21 19.05,29.21 C2.- 6.35,38.1 -V.1 -V2.1
GND  (1 unrouted)
  pour Bottom: 0,77.47 111.76,77.47 111.76,0 0,0
N$1  (3 unrouted)
  Top 0.305: 3.3V1.1 3.3V.1
N$2
  Top 0.305: TNSY_17.1 44.35,48.16 44.35,69.6 49.53,74.78 17.1
N$3
  Top 0.305: 1_TX1.1 22.23,67.94 24.92,67.94 26.09,66.78 26.09,63.73 24.13,61.78 TNSY_1.1
N$4
  Top 0.305: TNSY_16.1 45.03,46.3 45.03,69.32 46.25,70.54 46.41,70.54 16.1
N$5  (2 unrouted)
N$6  (3 unrouted)
N$7  (6 unrouted)
  Top 0.305: 5V.1 5V1.1
N$8  (1 unrouted)
N$9
  Top 0.305: 0_RX1.1 20.37,67.26 24.64,67.26 25.35,66.55 25.35,66.09 25.4,66.04 25.4,64.77 TNSY_0.1
N$10
  Top 0.305: 7_RX2.1 29.21,71.49 30.2,70.5 30.2,51.79 TNSY_7.1
N$11
  Top 0.305: 18.1 46.99,73.21 43.66,69.89 43.66,50.01 TNSY_18.1
N$12
  Top 0.305: 19.1 44.45,71.64 42.98,70.17 42.98,51.87 TNSY_19.1
N$13
  Top 0.305: 20.1 41.91,69.85 42.29,69.47 42.29,53.72 TNSY_20.1
N$14
  Top 0.305: 21.1 39.37,71.12 41.6,68.89 41.6,55.58 TNSY_21.1
N$15
  Top 0.305: 22.1 36.83,72.39 40.64,68.58 40.64,57.15 TNSY_22.1
N$16
  Top 0.305: 23.1 34.29,63.5 TNSY_23.1
N$17
  Top 0.305: 8_TX2.1 31.75,50.8 TNSY_8.1
N$18
  Top 0.305: 15.1 48.26,69.85 46.54,69.85 45.72,69.03 45.72,44.45 TNSY_15.1
N$19
  Top 0.305: 2.1 24.08,68.63 25.2,68.63 26.77,67.06 26.77,61.88 24.13,59.24 TNSY_2.1
N$20
  Top 0.305: TNSY_3.1 24.13,56.7 27.46,60.02 27.46,67.79 3.1
N$21
  Top 0.305: TNSY_4.1 24.13,54.16 28.14,58.17 28.14,69.65 4.1
N$22
  Top 0.305: 5.1 24.13,74.63 28.83,69.93 28.83,56.31 24.13,51.62 TNSY_5.1
N$23
  Top 0.305: PIXI_0.1 R1.1
N$24
  Bottom 0.305: R1.2 72.39,19.05 72.39,7.62 70.74,5.97 44.07,5.97 IO_0.1
N$25
  Top 0.305: R2.1 69.85,23.17 71.07,21.95 71.07,10.93 69.85,9.71 PIXI_1.1
N$26
  Top 0.305: 6.1 26.67,73.06 29.52,70.22 29.52,53.65 TNSY_6.1
N$27
  Top 0.305: R2.2 63.5,25.4 45.72,25.4 44.45,24.13 44.45,8.89 IO_1.1
N$28  (3 unrouted)
N$29  (3 unrouted)
N$30
  Top 0.305: PIXI_2.1 R3.1
N$31  (3 unrouted)
N$32  (2 unrouted)
N$33
  Bottom 0.305: R3.2 71.12,17.78 71.12,7.62 70.16,6.66 39.67,6.66 IO_2.1
N$34
  Top 0.305: R4.1 67.31,23.17 68.53,21.95 68.53,10.93 67.31,9.71 PIXI_3.1
N$35
  Top 0.305: R4.2 61.65,26.09 45.44,26.09 43.76,24.41 43.76,13.28 IO_3.1
N$36
  Top 0.305: PIXI_4.1 R5.1
N$37
  Bottom 0.305: R5.2 58.42,15.24 43.18,15.24 IO_4.1
N$38
  Top 0.305: R6.1 64.77,23.17 65.99,21.95 65.99,10.93 64.77,9.71 PIXI_5.1
N$39
  Top 0.305: R6.2 59.79,26.77 45.15,26.77 43.08,24.7 43.08,17.78 26.67,1.37 IO_5.1
N$40
  Top 0.305: PIXI_6.1 R7.1
N$41
  Bottom 0.305: R7.2 56.57,15.93 38.79,15.93 IO_6.1
N$42
  Top 0.305: R8.1 62.23,23.17 63.45,21.95 63.45,10.93 62.23,9.71 PIXI_7.1
N$43
  Top 0.305: R8.2 57.94,27.46 44.87,27.46 42.39,24.98 42.39,22.07 IO_7.1
N$44
  Top 0.305: PIXI_8.1 R9.1
N$45
  Bottom 0.305: R9.2 54.71,16.61 34.39,16.61 IO_8.1
N$46
  Top 0.305: R10.1 59.69,23.17 60.91,21.95 60.91,10.93 59.69,9.71 PIXI_9.1
N$47
  Top 0.305: R10.2 56.08,28.14 43.38,28.14 IO_9.1
N$48
  Top 0.305: PIXI_10.1 R11.1
N$49
  Bottom 0.305: R11.2 52.86,17.3 14.76,17.3 7.62,10.16 IO_10.1
N$50
  Top 0.305: R12.1 57.15,23.17 58.37,21.95 58.37,10.93 57.15,9.71 PIXI_11.1
N$51
  Top 0.305: R12.2 54.23,28.83 43.1,28.83 26.97,12.7 IO_11.1
N$52
  Top 0.305: PIXI_12.1 R13.1
N$53
  Bottom 0.305: R13.2 51,17.98 14.17,17.98 11.43,15.24 IO_12.1
N$54
  Top 0.305: R14.1 54.61,23.17 55.83,21.95 55.83,10.93 54.61,9.71 PIXI_13.1
N$55
  Top 0.305: R14.2 52.38,29.52 42.81,29.52 31.08,17.78 IO_13.1
N$56
  Top 0.305: PIXI_14.1 R15.1
N$57
  Bottom 0.305: R15.2 49.15,18.67 13.08,18.67 11.43,20.32 IO_14.1
N$58
  Top 0.305: R16.1 52.07,23.17 53.29,21.95 53.29,10.93 52.07,9.71 PIXI_15.1
N$59
  Top 0.305: R16.2 50.52,30.2 42.53,30.2 35.19,22.86 IO_15.1
N$60
  Top 0.305: PIXI_16.1 R17.1
N$61
  Bottom 0.305: R17.2 47.3,19.36 13.66,19.36 7.62,25.4 IO_16.1
N$62
  Top 0.305: R18.1 49.53,23.17 50.75,21.95 50.75,10.93 49.53,9.71 PIXI_17.1
N$63
  Top 0.305: R18.2 48.57,31.75 47.45,32.87 46.53,32.87 44.55,30.89 42.25,30.89 39.3,27.94 IO_17.1
N$64
  Top 0.305: PIXI_18.1 R19.1
N$65
  Bottom 0.305: R19.2 45.44,20.04 14.25,20.04 3.81,30.48 IO_18.1
N$66
  Top 0.305: D3.C R21.1 AVDDIO1.1 AVDDIO2.1 104.14,49.53 104.14,67.31 AVDDIO.1
N$67
  Top 0.305: D2.A R22.1 AVSSIO1.1 AVSSIO2.1 104.14,45.72 105.41,46.99 105.41,68.58 AVSSIO.1
N$68
  Top 0.305: R20.1 46.99,23.17 48.21,21.95 48.21,10.93 46.99,9.71 PIXI_19.1
N$69
  Bottom 0.305: R20.2 43.18,27.94 7.62,27.94 2.54,33.02 IO_19.1
N$70
  Top 0.305: PIXI_20.1 R23.1
N$71
  Bottom 0.305: R23.2 100.33,15.55 101.55,14.33 101.55,8.38 100.33,7.17 IO_20.1
N$72
  Top 0.305: R24.1 100.33,23.17 101.55,21.95 101.55,10.93 100.33,9.71 PIXI_21.1
N$73
  Top 0.305: R24.2 100.33,29.59 104.98,24.94 104.98,7.93 101.92,4.88 100.13,4.88 97.79,2.54 IO_21.1
N$74
  Top 0.305: PIXI_22.1 R25.1
N$75
  Bottom 0.305: R25.2 97.79,15.55 99.01,14.33 99.01,5.03 IO_22.1
N$76
  Top 0.305: R26.1 97.79,23.17 99.01,21.95 99.01,10.93 97.79,9.71 PIXI_23.1
N$77
  Top 0.305: R26.2 97.79,31.16 104.29,24.66 104.29,8.22 101.64,5.56 95.73,5.56 92.71,2.54 IO_23.1
N$78
  Top 0.305: PIXI_24.1 R27.1
N$79
  Bottom 0.305: R27.2 95.25,15.55 96.47,14.33 96.47,7.57 IO_24.1
N$80
  Top 0.305: R28.1 95.25,23.17 96.47,21.95 96.47,10.93 95.25,9.71 PIXI_25.1
N$81
  Top 0.305: R28.2 100.38,26.62 101.36,26.62 103.61,24.37 103.61,8.5 101.35,6.25 91.34,6.25 87.63,2.54 IO_25.1
N$82
  Top 0.305: PIXI_26.1 R29.1
N$83
  Bottom 0.305: R29.2 92.71,15.55 93.93,14.33 93.93,8.94 93.98,8.89 93.93,8.84 93.93,8.38 93.16,7.62 90.17,7.62 85.09,2.54 IO_26.1
N$84
  Top 0.305: R30.1 92.71,23.17 93.93,21.95 93.93,10.93 92.71,9.71 PIXI_27.1
N$85
  Top 0.305: R30.2 98.53,25.93 101.08,25.93 102.92,24.09 102.92,8.79 101.07,6.93 86.94,6.93 82.55,2.54 IO_27.1
N$86
  Top 0.305: PIXI_28.1 R31.1
N$87
  Bottom 0.305: R31.2 88.9,20.32 88.9,7.62 83.82,2.54 81.28,2.54 IO_28.1
N$88
  Top 0.305: R32.1 90.17,23.17 91.39,21.95 91.39,10.93 90.17,9.71 PIXI_29.1
N$89
  Top 0.305: R32.2 96.67,25.25 100.79,25.25 102.23,23.81 102.23,9.07 100.78,7.62 82.55,7.62 77.47,2.54 IO_29.1
N$90
  Top 0.305: PIXI_30.1 R33.1
N$91
  Bottom 0.305: R33.2 81.28,15.24 77.16,15.24 76.2,14.28 76.2,6.35 72.39,2.54 71.12,2.54 IO_30.1
N$92
  Top 0.305: R34.1 87.63,23.17 88.85,21.95 88.85,10.93 87.63,9.71 PIXI_31.1
N$93
  Top 0.305: R34.2 81.13,25.25 77.01,25.25 76.2,24.44 76.2,6.35 72.39,2.54 68.58,2.54 IO_31.1
N$94
  Top 0.305: PIXI_32.1 R35.1
N$95
  Bottom 0.305: R35.2 79.43,15.93 76.88,15.93 75.51,14.56 75.51,6.63 72.11,3.23 65.46,3.23 64.77,2.54 IO_32.1
N$96
  Top 0.305: R36.1 85.09,23.17 86.31,21.95 86.31,10.93 85.09,9.71 PIXI_33.1
N$97
  Top 0.305: R36.2 79.27,25.93 76.72,25.93 75.51,24.73 75.51,6.63 72.11,3.23 64.19,3.23 IO_33.1
N$98
  Top 0.305: PIXI_34.1 R37.1
N$99
  Bottom 0.305: R37.2 77.57,16.61 76.59,16.61 74.83,14.85 74.83,6.92 71.82,3.91 61.06,3.91 59.69,2.54 IO_34.1
N$100
  Top 0.305: R38.1 82.55,23.17 83.77,21.95 83.77,10.93 82.55,9.71 PIXI_35.1
N$101
  Top 0.305: R38.2 77.42,26.62 76.44,26.62 74.83,25.01 74.83,6.92 71.82,3.91 63.9,3.91 63.8,3.81 58.42,3.81 57.15,2.54 IO_35.1
N$102
  Top 0.305: PIXI_36.1 R39.1
N$103
  Bottom 0.305: R39.2 74.14,15.72 74.14,7.2 71.54,4.6 71.12,4.6 56.67,4.6 54.61,2.54 IO_36.1
N$104
  Top 0.305: PIXI_37.1 80.01,9.71 81.23,10.93 81.23,21.95 80.01,23.17 R40.1
N$105
  Top 0.305: R40.2 80.01,31.16 74.14,25.29 74.14,7.2 71.54,4.6 54.13,4.6 52.07,2.54 IO_37.1
N$106
  Top 0.305: PIXI_38.1 R41.1
N$107
  Bottom 0.305: R41.2 73.46,17.58 73.46,7.49 71.25,5.28 52.27,5.28 49.53,2.54 IO_38.1
N$108
  Top 0.305: R42.1 77.47,23.17 78.69,21.95 78.69,10.93 77.47,9.71 PIXI_39.1
N$109
  Top 0.305: R42.2 73.46,27.74 73.46,7.62 71.12,5.28 49.73,5.28 46.99,2.54 IO_39.1

### Text on the board
tNames: PIXI | PIXI | TEENSY4 | Rob Ellis 2020 | PGTNX01